# Altium schematic sheet MCU.SchDoc
size A3
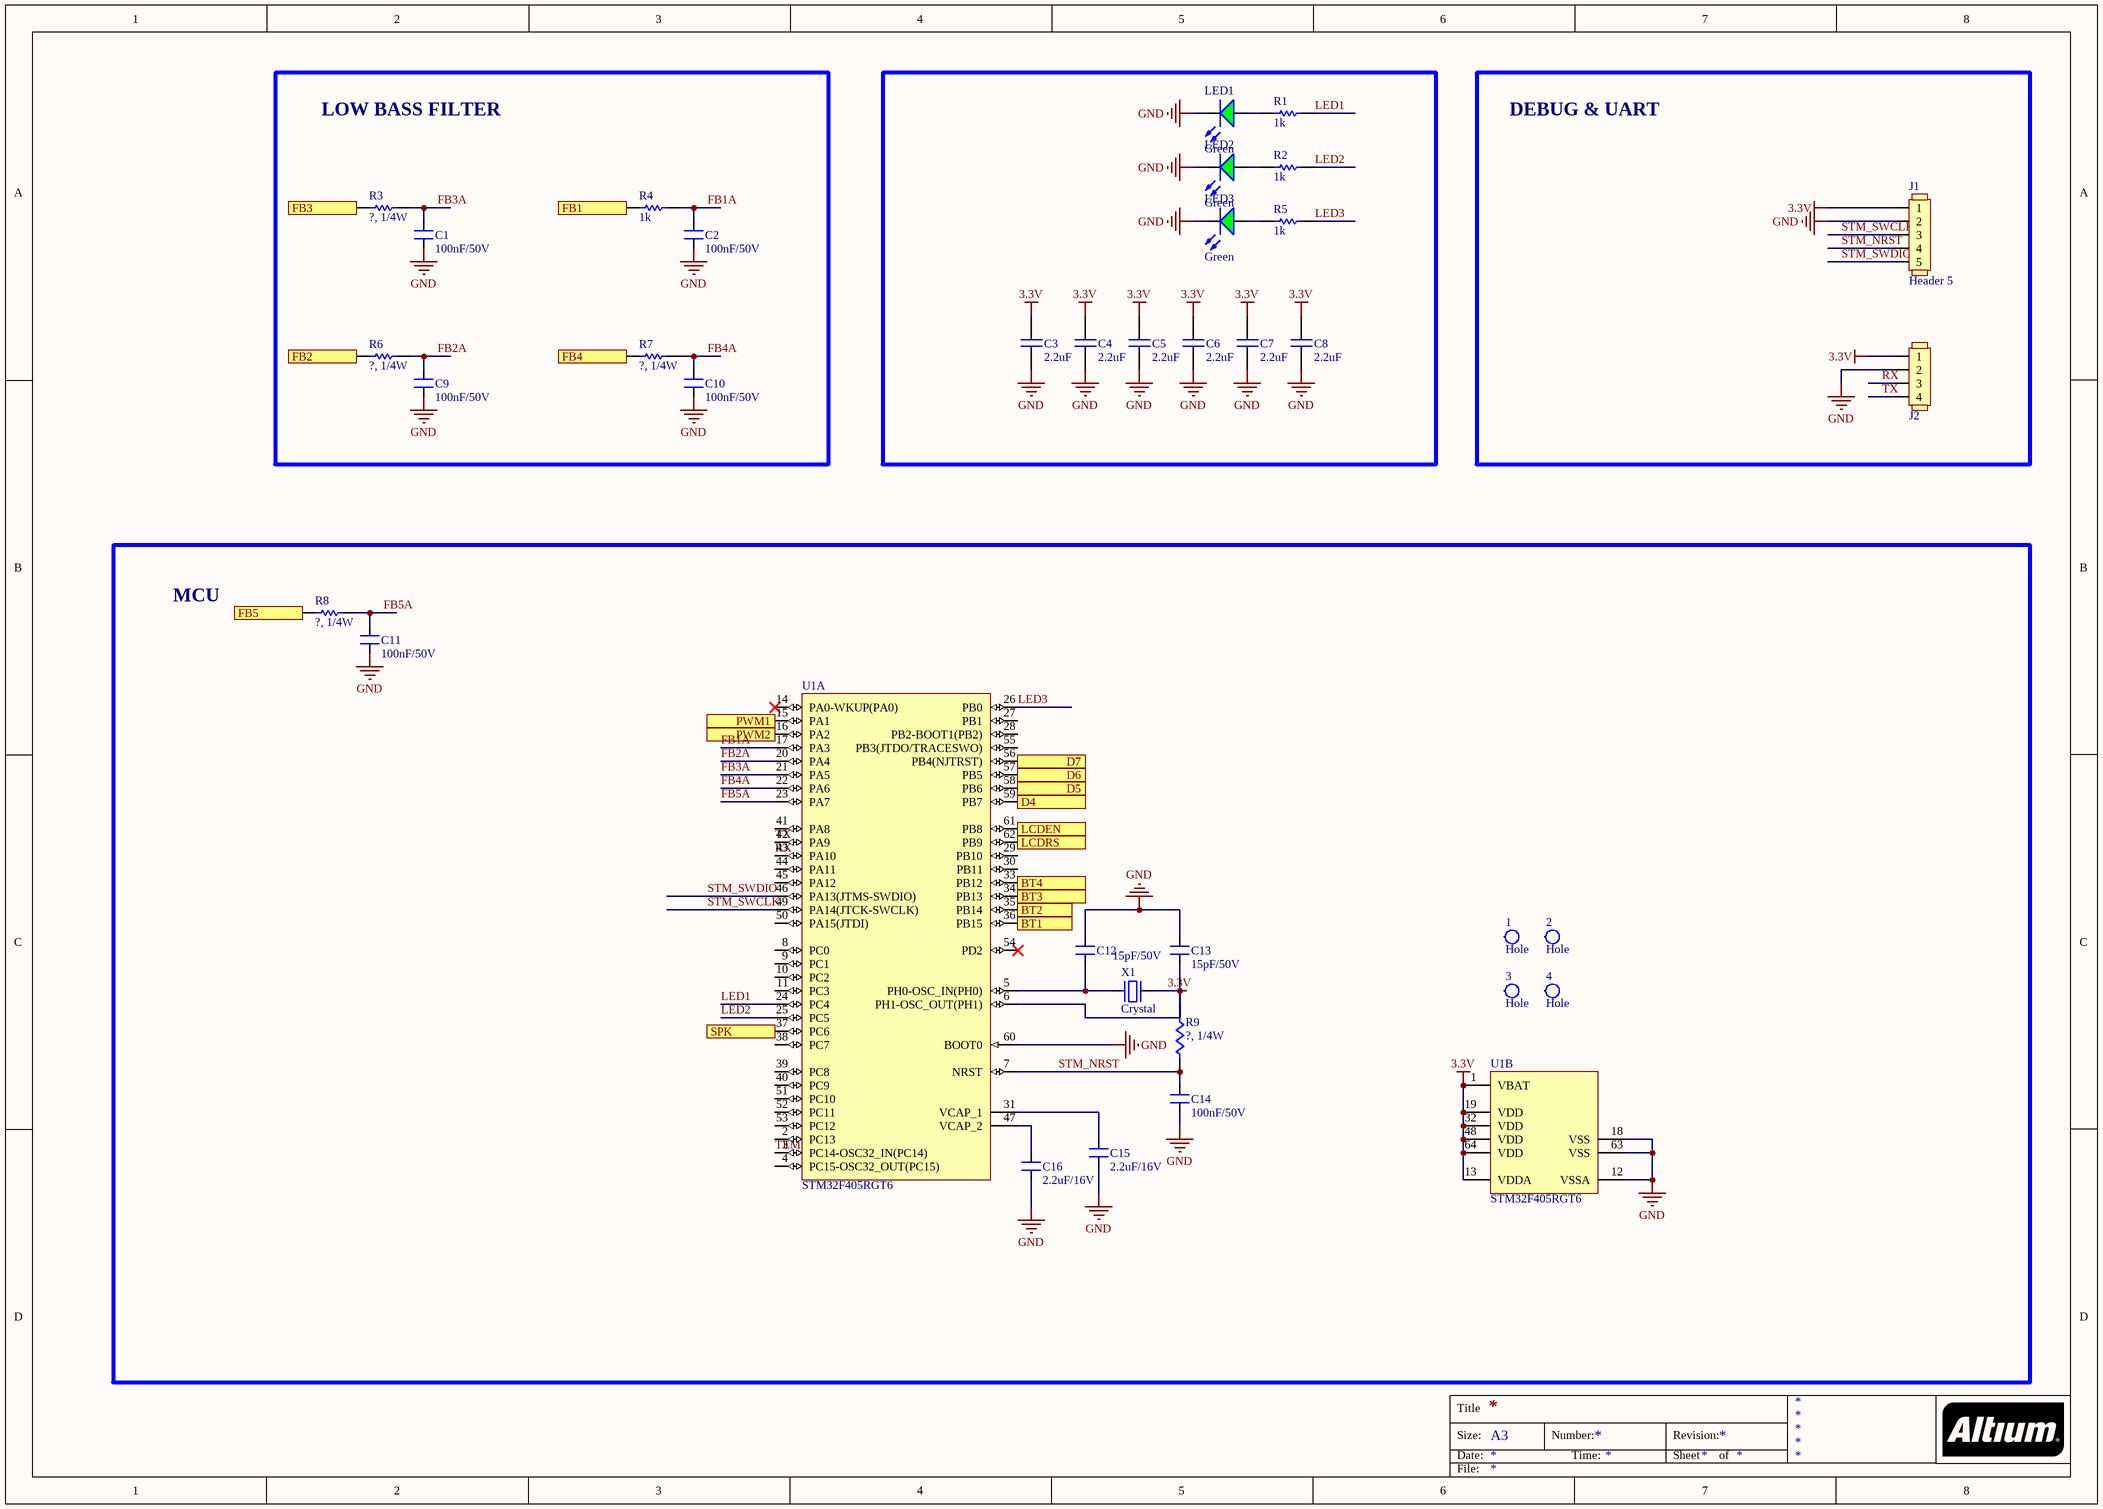
[diagram p0: MCU.SchDoc]

## Parts
1  Hole  [Screw 3.0]
2  Hole  [Screw 3.0]
3  Hole  [Screw 3.0]
4  Hole  [Screw 3.0]
C1  100nF/50V  [CAP 0603(1508)]
C2  100nF/50V  [CAP 0603(1508)]
C3  2.2uF  [CAP 0603(1508)]
C4  2.2uF  [CAP 0603(1508)]
C5  2.2uF  [CAP 0603(1508)]
C6  2.2uF  [CAP 0603(1508)]
C7  2.2uF  [CAP 0603(1508)]
C8  2.2uF  [CAP 0603(1508)]
C9  100nF/50V  [CAP 0603(1508)]
C10  100nF/50V  [CAP 0603(1508)]
C11  100nF/50V  [CAP 0603(1508)]
C12  15pF/50V  [CAP 0603(1508)]
C13  15pF/50V  [CAP 0603(1508)]
C14  100nF/50V  [CAP 0603(1508)]
C15  2.2uF/16V  [CAP 0603(1508)]
C16  2.2uF/16V  [CAP 0603(1508)]
J1  Header 5  [HEADER x5]
J2  Header 4  [HEADER x4]  (value not drawn)
LED1  value Green  [LED0805GREEN]  (hidden comment: LED_GREEN)
LED2  value Green  [LED0805GREEN]  (hidden comment: LED_GREEN)
LED3  value Green  [LED0805GREEN]  (hidden comment: LED_GREEN)
R1  1k  [RES 0603(1508)]
R2  1k  [RES 0603(1508)]
R3  ?, 1/4W  [RES 0603(1508)]
R4  1k  [RES 0603(1508)]
R5  1k  [RES 0603(1508)]
R6  ?, 1/4W  [RES 0603(1508)]
R7  ?, 1/4W  [RES 0603(1508)]
R8  ?, 1/4W  [RES 0603(1508)]
R9  ?, 1/4W  [RES 0603(1508)]
U1  STM32F405RGT6  [STM-LQFP64_N]  (parts A,B of 2)
X1  Crystal  [Crystal]

## Blocks framed on the sheet
LOW BASS FILTER: C1 C2 C9 C10 R3 R4 R6 R7
DEBUG & UART: J1 J2
MCU: 1-4 C11-C16 R8 R9 U1 X1

## Ports
BT1, BT2, BT3, BT4, D4, D5, D6, D7, FB1, FB2, FB3, FB4, FB5, LCDEN, LCDRS, PWM1, PWM2, SPK

## Nets
3.3V: C3.2 C4.2 C5.2 C6.2 C7.2 C8.2 C13.1 J1.1 J2.1 R9.2 U1.1(VBAT) U1.6(PH1-OSC_OUT(PH1)) U1.13(VDDA) U1.19(VDD) U1.32(VDD) U1.48(VDD) U1.64(VDD) X1.2
GND: C1.1 C2.1 C3.1 C4.1 C5.1 C6.1 C7.1 C8.1 C9.1 C10.1 C11.1 C12.2 C13.2 C14.1 C15.2 C16.1 J1.2 J2.2 LED1.2(K) LED2.2(K) LED3.2(K) U1.12(VSSA) U1.18(VSS) U1.60(BOOT0) U1.63(VSS)
BT1: U1.36(PB15) ; port BT1
BT2: U1.35(PB14) ; port BT2
BT3: U1.34(PB13) ; port BT3
BT4: U1.33(PB12) ; port BT4
D4: U1.59(PB7) ; port D4
D5: U1.58(PB6) ; port D5
D6: U1.57(PB5) ; port D6
D7: U1.56(PB4(NJTRST)) ; port D7
FB1: R4.2 ; port FB1
FB1A: C2.2 R4.1 U1.17(PA3)
FB2: R6.2 ; port FB2
FB2A: C9.2 R6.1 U1.20(PA4)
FB3: R3.2 ; port FB3
FB3A: C1.2 R3.1 U1.21(PA5)
FB4: R7.2 ; port FB4
FB4A: C10.2 R7.1 U1.22(PA6)
FB5: R8.2 ; port FB5
FB5A: C11.2 R8.1 U1.23(PA7)
LCDEN: U1.61(PB8) ; port LCDEN
LCDRS: U1.62(PB9) ; port LCDRS
LED1: R1.1 U1.24(PC4)
LED2: R2.1 U1.25(PC5)
LED3: R5.1 U1.26(PB0)
PWM1: U1.15(PA1) ; port PWM1
PWM2: U1.16(PA2) ; port PWM2
RX: J2.3 U1.43(PA10)
SPK: U1.37(PC6) ; port SPK
STM_NRST: C14.2 J1.4 R9.1 U1.7(NRST)
STM_SWCLK: J1.3 U1.49(PA14(JTCK-SWCLK))
STM_SWDIO: J1.5 U1.46(PA13(JTMS-SWDIO))
TEM: U1.3(PC14-OSC32_IN(PC14))
TX: J2.4 U1.42(PA9)
NetC12_1: C12.1 U1.5(PH0-OSC_IN(PH0)) X1.1
NetC15_1: C15.1 U1.31(VCAP_1)
NetC16_2: C16.2 U1.47(VCAP_2)
NetLED1_1: LED1.1(A) R1.2
NetLED2_1: LED2.1(A) R2.2
NetLED3_1: LED3.1(A) R5.2

Not connected (* = marked no-connect by the designer): 1 1; 2 1; 3 1; 4 1; U1 2(PC13) 4(PC15-OSC32_OUT(PC15)) 8(PC0) 9(PC1) 10(PC2) 11(PC3) 14(PA0-WKUP(PA0))* 27(PB1) 28(PB2-BOOT1(PB2)) 29(PB10) 30(PB11) 38(PC7) 39(PC8) 40(PC9) 41(PA8) 44(PA11) 45(PA12) 50(PA15(JTDI)) 51(PC10) 52(PC11) 53(PC12) 54(PD2)* 55(PB3(JTDO/TRACESWO))

## Notes on the sheet
- Title
- Size:
- Date:
- A3
- Number:
- Time:
- Revision:
- Sheet
- of
- File:

## Library data of the parts
C1 C2 C9-C11 C14 = CAP_CER_100nF_50V_NPOL: Ceramic Capacitor 100nF/50V (+-20% TH)/(+10%SMD)
C3-C8 = Cap2: Non_Polarized Capacitor
C12 C13 = CAP_CER_15pF_50V_NPOL: Ceramic Capacitor 15pF/50V (+-10% TH)/(+5%SMD)
C15 C16 = CAP_CER_2.2uF_16V_NPOL: Ceramic Capacitor 2.2uF/16V (+-10% TH)/(+10%SMD)
LED1-LED3 = LED_GREEN: LED Green; ComponentLink1Description: Datasheet; ComponentLink1URL: D:\Dropbox\Datasheets\Opto and Illumination\LEDs\SMD LED.pdf; Unit Price: 0.0476
R1-R9 = Resistor 1/4W: Resistor through hole 1/4W
U1 = STM32F405RGT6: ARM Cortex-M4 32-bit MCU+FPU, 210 DMIPS, 1024 kB Flash, 192 kB Internal RAM, 51 I/Os, 64-pin LQFP, -40 to 85 degC, Tray; Manufacturer: STMicroelectronics; D/A Converter: 2x12-bit; FLASH Size (Prog) (kB): 1024; I/Os (High Current): 51; Internal RAM Size (kB): 192; Operating Frequency(F) (Processor speed) (MHz): 168; Supply Voltage(Vcc) max (V): 3.6; Supply Voltage(Vcc) min (V): 1.8; DatasheetVersion: Rev. 4; PackageVersion: Rev. 4, 06/2013; PackageReference: LQFP64; PackageDescription: 64-Pin Low Profile Quad Flat Package, 10 x 10 mm Body, 0.5 mm Pitch; Supplier 1: Digi-Key; Supplier Part Number 1: 497-11767-ND; Supplier 2: Farnell; Supplier Part Number 2: 2064363; Supplier 3: Newark; Supplier Part Number 3: 73T2329; Supplier 4: Mouser; Supplier Part Number 4: 511-STM32F405RGT6; Core: ARM Cortex-M4; Packing: Tray; Mounting Technology: Surface Mount; PartNumber: STM32F405RGT6; ComponentLink1Description: Manufacturer URL; ComponentLink1URL: http://www.st.com/web/en/home.html; ComponentLink2Description: Datasheet; ComponentLink2URL: http://www.st.com/st-web-ui/static/active/en/resource/technical/document/datasheet/DM00037051.pdf; ComponentLink3Description: Package Specification; ComponentLink3URL: http://www.st.com/st-web-ui/static/active/en/resource/technical/document/datasheet/DM00037051.pdf
X1 = Crystal: Crystal through hole